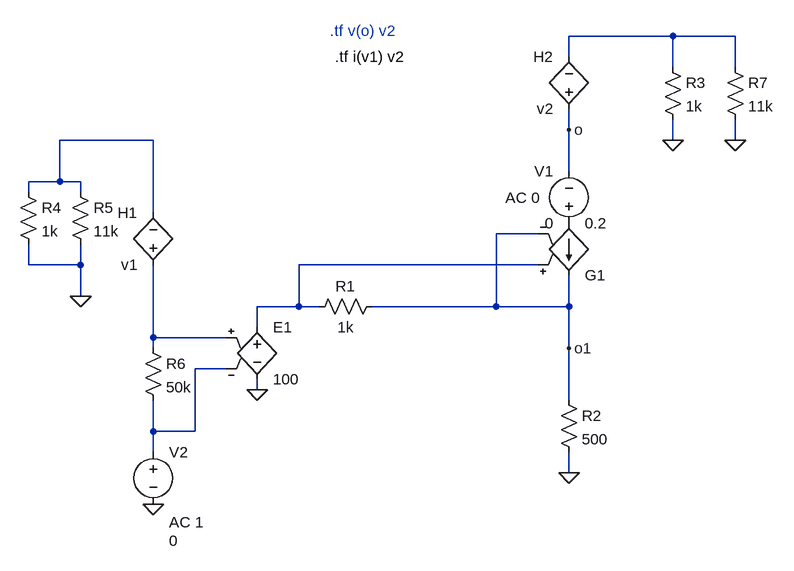
[diagram p0: schematic pruebametodo7.asc]
pruebametodo7.asc, the LTspice schematic file:
Version 4
SHEET 1 1112 1092
WIRE 880 -320 720 -320
WIRE 976 -320 880 -320
WIRE 720 -288 720 -320
WIRE 880 -272 880 -320
WIRE 976 -272 976 -320
WIRE 720 -176 720 -208
WIRE 80 -160 -64 -160
WIRE 880 -160 880 -192
WIRE 976 -160 976 -192
WIRE 720 -112 720 -176
WIRE -64 -96 -64 -160
WIRE -64 -96 -112 -96
WIRE -32 -96 -64 -96
WIRE -112 -80 -112 -96
WIRE -32 -80 -32 -96
WIRE 80 -48 80 -160
WIRE 672 -16 608 -16
WIRE -112 32 -112 0
WIRE -32 32 -32 0
WIRE -32 32 -112 32
WIRE 672 32 304 32
WIRE -32 80 -32 32
WIRE 304 96 304 32
WIRE 304 96 240 96
WIRE 336 96 304 96
WIRE 608 96 608 -16
WIRE 608 96 416 96
WIRE 720 96 720 48
WIRE 720 96 608 96
WIRE 240 128 240 96
WIRE 80 144 80 32
WIRE 192 144 80 144
WIRE 80 160 80 144
WIRE 720 160 720 96
WIRE 192 192 144 192
WIRE 240 224 240 208
WIRE 720 240 720 160
WIRE 80 288 80 240
WIRE 144 288 144 192
WIRE 144 288 80 288
WIRE 80 320 80 288
WIRE 720 352 720 320
FLAG 720 352 0
FLAG 880 -160 0
FLAG 720 160 o1
FLAG 720 -176 o
FLAG 80 400 0
FLAG 240 224 0
FLAG -32 80 0
FLAG 976 -160 0
SYMBOL e 240 112 R0
SYMATTR InstName E1
SYMATTR Value 100
SYMBOL res 320 112 R270
WINDOW 0 32 56 VTop 2
WINDOW 3 0 56 VBottom 2
SYMATTR InstName R1
SYMATTR Value 1k
SYMBOL g 720 64 M180
SYMATTR InstName G1
SYMATTR Value 0.2
SYMBOL res 704 224 R0
SYMATTR InstName R2
SYMATTR Value 500
SYMBOL res 864 -288 R0
SYMATTR InstName R3
SYMATTR Value 1k
SYMBOL res 64 144 R0
SYMATTR InstName R6
SYMATTR Value 50k
SYMBOL voltage 720 -16 R180
WINDOW 0 24 96 Left 2
WINDOW 3 24 16 Left 2
WINDOW 123 45 55 Left 2
WINDOW 39 0 0 Left 0
SYMATTR InstName V1
SYMATTR Value 0
SYMATTR Value2 AC 0
SYMBOL voltage 80 304 R0
WINDOW 3 24 152 Left 2
WINDOW 123 24 124 Left 2
WINDOW 39 0 0 Left 0
SYMATTR Value 0
SYMATTR Value2 AC 1
SYMATTR InstName V2
SYMBOL h 80 48 R180
WINDOW 0 24 96 Left 2
WINDOW 3 24 16 Left 2
SYMATTR InstName H1
SYMATTR Value v1
SYMATTR Value2 83.3333333333
SYMBOL res -128 -96 R0
SYMATTR InstName R4
SYMATTR Value 1k
SYMBOL res -48 -96 R0
SYMATTR InstName R5
SYMATTR Value 11k
SYMBOL h 720 -192 R180
WINDOW 0 24 96 Left 2
WINDOW 3 24 16 Left 2
SYMATTR InstName H2
SYMATTR Value v2
SYMATTR Value2 -83.3333333333
SYMBOL res 960 -288 R0
SYMATTR InstName R7
SYMATTR Value 11k
TEXT 352 -328 Left 2 ;.tf v(o) v2
TEXT 360 -288 Left 2 !.tf i(v1) v2

The netlist it stands for:
* pruebametodo7.asc
E1 N003 0 N004 N005 100
R1 N003 o1 1k
G1 P001 o1 N003 o1 0.2
R2 o1 0 500
R3 N001 0 1k
R6 N004 N005 50k
V1 P001 o 0 AC 0
V2 N005 0 0 AC 1
H1 N004 N002 v1 83.3333333333
R4 N002 0 1k
R5 N002 0 11k
H2 o N001 v2 -83.3333333333
R7 N001 0 11k
* .tf v(o) v2
.tf i(v1) v2
.backanno
.end